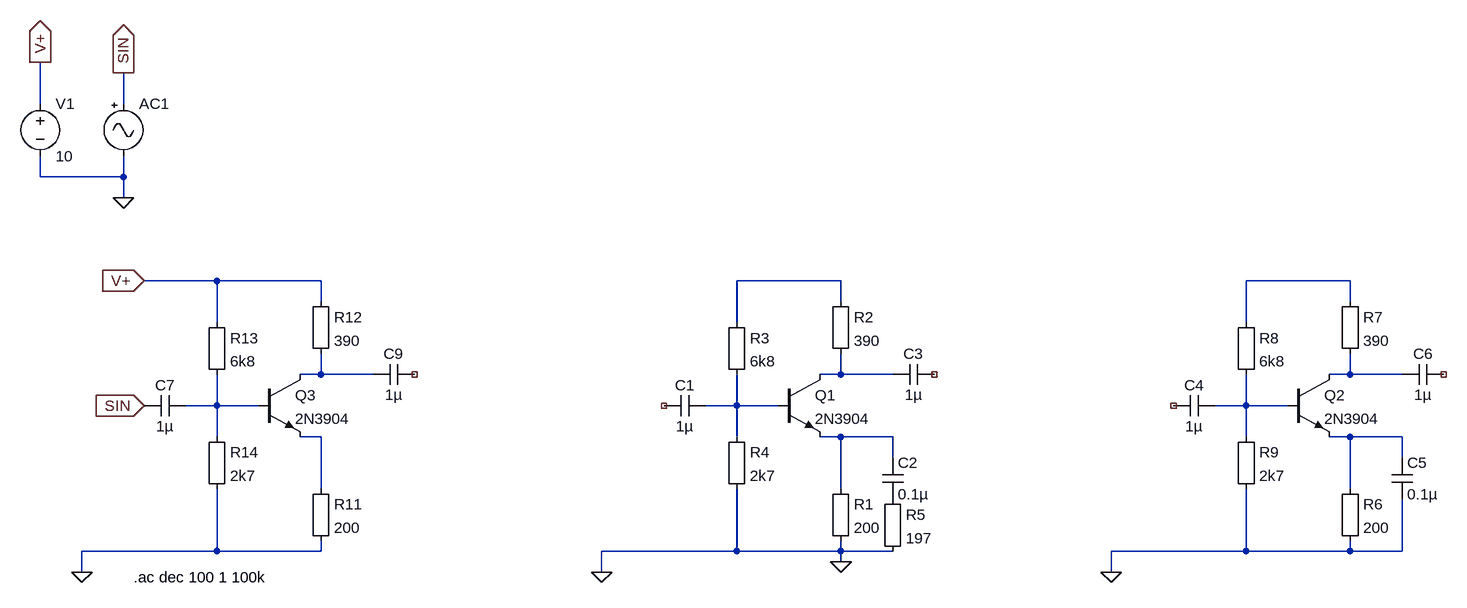
[diagram p0: schematic Transistorarbeitspunkt.asc]
Transistorarbeitspunkt.asc, the LTspice schematic file:
Version 4
SHEET 1 1160 680
WIRE -1008 -432 -1008 -496
WIRE -880 -432 -880 -480
WIRE -1008 -320 -1008 -352
WIRE -880 -320 -880 -352
WIRE -880 -320 -1008 -320
WIRE -880 -288 -880 -320
WIRE -736 -160 -848 -160
WIRE -576 -160 -736 -160
WIRE 224 -160 64 -160
WIRE 1008 -160 848 -160
WIRE -576 -128 -576 -160
WIRE 224 -128 224 -160
WIRE 1008 -128 1008 -160
WIRE -736 -96 -736 -160
WIRE 64 -96 64 -160
WIRE 848 -96 848 -160
WIRE -576 -16 -576 -48
WIRE -576 -16 -608 -16
WIRE -496 -16 -576 -16
WIRE 224 -16 224 -48
WIRE 224 -16 192 -16
WIRE 304 -16 224 -16
WIRE 1008 -16 1008 -48
WIRE 1008 -16 976 -16
WIRE 1088 -16 1008 -16
WIRE -736 32 -736 -16
WIRE -736 32 -784 32
WIRE -672 32 -736 32
WIRE 64 32 64 -16
WIRE 64 32 16 32
WIRE 128 32 64 32
WIRE 848 32 848 -16
WIRE 848 32 800 32
WIRE 912 32 848 32
WIRE -736 80 -736 32
WIRE -576 80 -608 80
WIRE 64 80 64 32
WIRE 224 80 192 80
WIRE 304 80 224 80
WIRE 848 80 848 32
WIRE 1008 80 976 80
WIRE 1088 80 1008 80
WIRE 304 112 304 80
WIRE 1088 112 1088 80
WIRE -576 160 -576 80
WIRE 224 160 224 80
WIRE 1008 160 1008 80
WIRE -736 256 -736 160
WIRE -736 256 -944 256
WIRE -576 256 -576 240
WIRE -576 256 -736 256
WIRE 64 256 64 160
WIRE 64 256 -144 256
WIRE 224 256 224 240
WIRE 224 256 64 256
WIRE 304 256 224 256
WIRE 848 256 848 160
WIRE 848 256 640 256
WIRE 1008 256 1008 240
WIRE 1008 256 848 256
WIRE 1088 256 1088 176
WIRE 1088 256 1008 256
WIRE 224 272 224 256
WIRE -944 288 -944 256
WIRE -144 288 -144 256
WIRE 640 288 640 256
FLAG 224 272 0
FLAG -144 288 0
FLAG 640 288 0
FLAG -944 288 0
FLAG -848 32 SIN
IOPIN -848 32 In
FLAG -880 -480 SIN
IOPIN -880 -480 Out
FLAG -880 -288 0
FLAG -1008 -496 V+
IOPIN -1008 -496 Out
FLAG -848 -160 V+
IOPIN -848 -160 In
SYMBOL EuropeanResistor 208 144 R0
SYMATTR InstName R1
SYMATTR Value 200
SYMBOL EuropeanResistor 208 -144 R0
SYMATTR InstName R2
SYMATTR Value 390
SYMBOL EuropeanResistor 48 -112 R0
SYMATTR InstName R3
SYMATTR Value 6k8
SYMBOL EuropeanResistor 48 64 R0
SYMATTR InstName R4
SYMATTR Value 2k7
SYMBOL npn 128 -16 R0
SYMATTR InstName Q1
SYMATTR Value 2N3904
SYMBOL cap -48 48 R270
WINDOW 0 32 32 VTop 2
WINDOW 3 0 32 VBottom 2
SYMATTR InstName C1
SYMATTR Value 1µ
SYMBOL EuropeanResistor 288 160 R0
SYMATTR InstName R5
SYMATTR Value 197
SYMBOL cap 288 112 R0
SYMATTR InstName C2
SYMATTR Value 0.1µ
SYMBOL cap 304 0 R270
WINDOW 0 32 32 VTop 2
WINDOW 3 0 32 VBottom 2
SYMATTR InstName C3
SYMATTR Value 1µ
SYMBOL EuropeanResistor 992 144 R0
SYMATTR InstName R6
SYMATTR Value 200
SYMBOL EuropeanResistor 992 -144 R0
SYMATTR InstName R7
SYMATTR Value 390
SYMBOL EuropeanResistor 832 -112 R0
SYMATTR InstName R8
SYMATTR Value 6k8
SYMBOL EuropeanResistor 832 64 R0
SYMATTR InstName R9
SYMATTR Value 2k7
SYMBOL npn 912 -16 R0
SYMATTR InstName Q2
SYMATTR Value 2N3904
SYMBOL cap 736 48 R270
WINDOW 0 32 32 VTop 2
WINDOW 3 0 32 VBottom 2
SYMATTR InstName C4
SYMATTR Value 1µ
SYMBOL cap 1072 112 R0
SYMATTR InstName C5
SYMATTR Value 0.1µ
SYMBOL cap 1088 0 R270
WINDOW 0 32 32 VTop 2
WINDOW 3 0 32 VBottom 2
SYMATTR InstName C6
SYMATTR Value 1µ
SYMBOL EuropeanResistor -592 144 R0
SYMATTR InstName R11
SYMATTR Value 200
SYMBOL EuropeanResistor -592 -144 R0
SYMATTR InstName R12
SYMATTR Value 390
SYMBOL EuropeanResistor -752 -112 R0
SYMATTR InstName R13
SYMATTR Value 6k8
SYMBOL EuropeanResistor -752 64 R0
SYMATTR InstName R14
SYMATTR Value 2k7
SYMBOL npn -672 -16 R0
SYMATTR InstName Q3
SYMATTR Value 2N3904
SYMBOL cap -848 48 R270
WINDOW 0 32 32 VTop 2
WINDOW 3 0 32 VBottom 2
SYMATTR InstName C7
SYMATTR Value 1µ
SYMBOL Misc\\signal -880 -448 R0
WINDOW 123 0 0 Left 2
WINDOW 39 0 0 Left 2
SYMATTR InstName AC1
SYMATTR Value ""
SYMBOL voltage -1008 -448 R0
WINDOW 123 0 0 Left 2
WINDOW 39 0 0 Left 2
SYMATTR InstName V1
SYMATTR Value 10
SYMBOL cap -496 0 R270
WINDOW 0 32 32 VTop 2
WINDOW 3 0 32 VBottom 2
SYMATTR InstName C9
SYMATTR Value 1µ
TEXT -864 296 Left 2 !.ac dec 100 1 100k

The netlist it stands for:
* Transistorarbeitspunkt.asc
R1 N010 0 200
R2 N001 N004 390
R3 N001 N007 6k8
R4 N007 0 2k7
Q1 N004 N007 N010 0 2N3904
C1 NC_01 N007 1µ
R5 P001 0 197
C2 N010 P001 0.1µ
C3 N004 NC_02 1µ
R6 N011 0 200
R7 N002 N005 390
R8 N002 N008 6k8
R9 N008 0 2k7
Q2 N005 N008 N011 0 2N3904
C4 NC_03 N008 1µ
C5 N011 0 0.1µ
C6 N005 NC_04 1µ
R11 N009 0 200
R12 V+ N003 390
R13 V+ N006 6k8
R14 N006 0 2k7
Q3 N003 N006 N009 0 2N3904
C7 SIN N006 1µ
V§AC1 SIN 0
V1 V+ 0 10
C9 N003 NC_05 1µ
.model NPN NPN
.model PNP PNP
.lib standard.bjt
.ac dec 100 1 100k
.backanno
.end